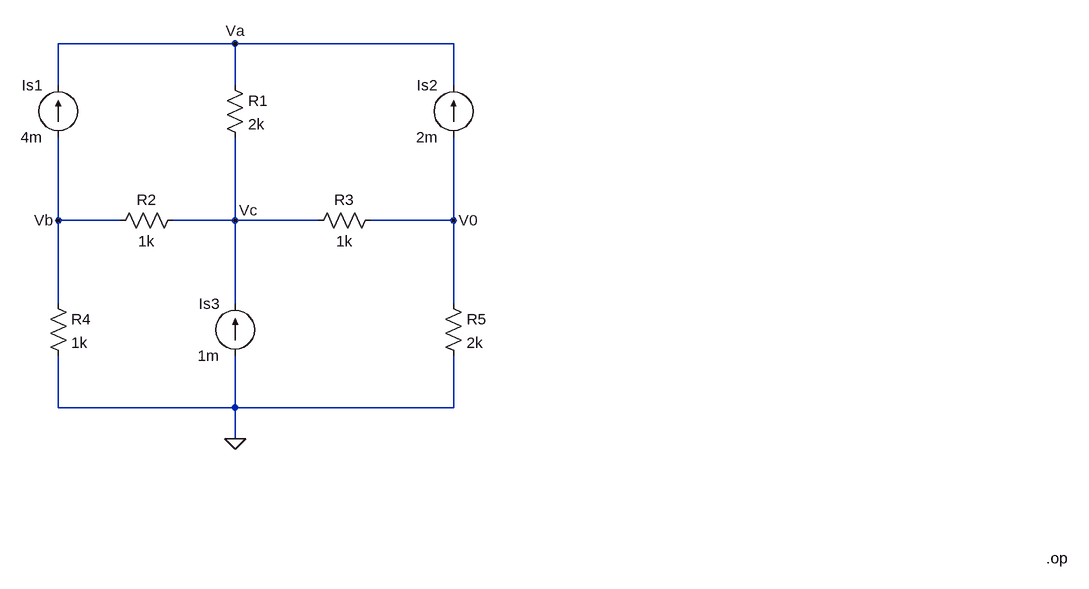
[diagram p0: schematic HW02-02.asc]
HW02-02.asc, the LTspice schematic file:
Version 4
SHEET 1 1592 824
WIRE 304 16 32 16
WIRE 640 16 304 16
WIRE 32 80 32 16
WIRE 304 80 304 16
WIRE 640 80 640 16
WIRE 32 288 32 160
WIRE 128 288 32 288
WIRE 304 288 304 160
WIRE 304 288 208 288
WIRE 432 288 304 288
WIRE 640 288 640 160
WIRE 640 288 512 288
WIRE 32 416 32 288
WIRE 304 416 304 288
WIRE 640 416 640 288
WIRE 32 576 32 496
WIRE 304 576 304 496
WIRE 304 576 32 576
WIRE 640 576 640 496
WIRE 640 576 304 576
WIRE 304 624 304 576
FLAG 640 288 V0
FLAG 304 288 Vc
FLAG 32 288 Vb
FLAG 304 16 Va
FLAG 304 624 0
SYMBOL current 32 160 R180
WINDOW 0 24 80 Left 2
WINDOW 3 24 0 Left 2
SYMATTR InstName Is1
SYMATTR Value 4m
SYMBOL res 288 64 R0
SYMATTR InstName R1
SYMATTR Value 2k
SYMBOL current 640 160 R180
WINDOW 0 24 80 Left 2
WINDOW 3 24 0 Left 2
SYMATTR InstName Is2
SYMATTR Value 2m
SYMBOL res 224 272 R90
WINDOW 0 0 56 VBottom 2
WINDOW 3 32 56 VTop 2
SYMATTR InstName R2
SYMATTR Value 1k
SYMBOL res 528 272 R90
WINDOW 0 0 56 VBottom 2
WINDOW 3 32 56 VTop 2
SYMATTR InstName R3
SYMATTR Value 1k
SYMBOL res 16 400 R0
SYMATTR InstName R4
SYMATTR Value 1k
SYMBOL res 624 400 R0
SYMATTR InstName R5
SYMATTR Value 2k
SYMBOL current 304 496 R180
WINDOW 0 24 80 Left 2
WINDOW 3 24 0 Left 2
SYMATTR InstName Is3
SYMATTR Value 1m
TEXT 1552 808 Left 2 !.op

The netlist it stands for:
* HW02-02.asc
Is1 Vb Va 4m
R1 Va Vc 2k
Is2 V0 Va 2m
R2 Vc Vb 1k
R3 V0 Vc 1k
R4 Vb 0 1k
R5 V0 0 2k
Is3 0 Vc 1m
.op
.backanno
.end

* Results of the author's LTspice run, read from the files saved beside the schematic
* Operating Point:
*   V(vb) = 200 mV
*   V(va) = 16.4 V
*   V(vc) = 4.4 V
*   V(v0) = 1.6 V
*   I(Is1) = 4 mA
*   I(Is2) = 2 mA
*   I(Is3) = 1 mA
*   I(R1) = 6 mA
*   I(R2) = 4.2 mA
*   I(R3) = -2.8 mA
*   I(R4) = 200 µA
*   I(R5) = 800 µA